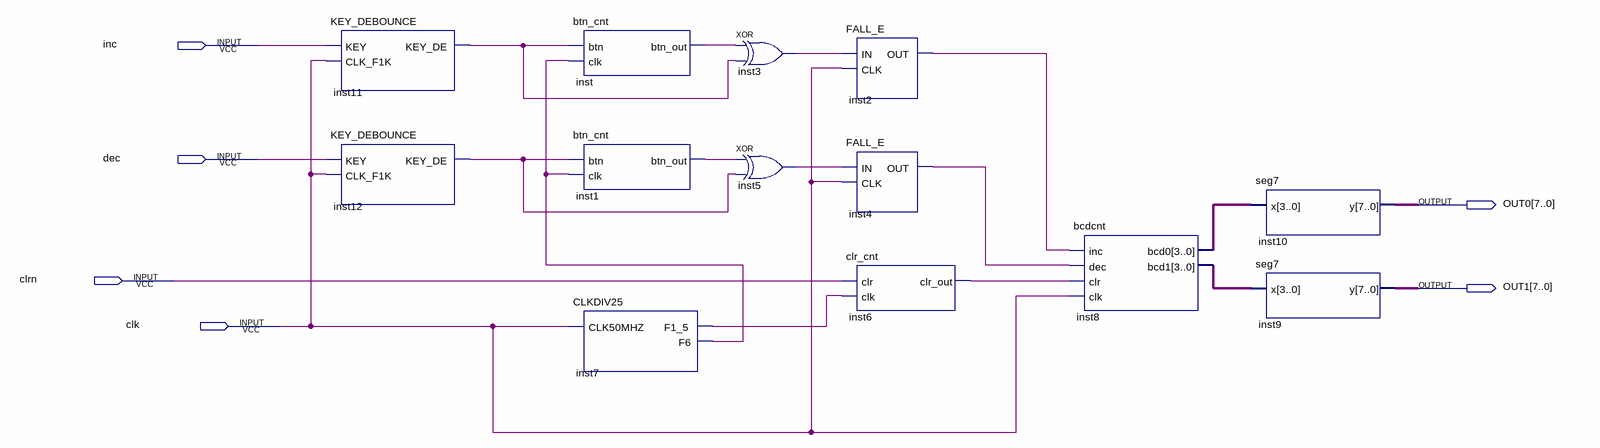
[diagram p0: schematic sheet]
// Quartus schematic TOP.bdf as structural Verilog: 13 symbols, 6 pins
module TOP (
  input  inc,
  input  dec,
  input  clrn,
  input  clk,
  output [7:0] OUT0,
  output [7:0] OUT1
);

  wire inst1_btn_out, inst2_out, inst3_out, inst4_out, inst5_out, inst6_clr_out, inst7_f1_5, inst7_f6,
       inst11_key_de, inst12_key_de, inst_btn_out;
  wire [3:0] inst8_bcd0, inst8_bcd1;

  KEY_DEBOUNCE inst11 (.KEY(inc), .CLK_F1K(clk), .KEY_DE(inst11_key_de));
  KEY_DEBOUNCE inst12 (.KEY(dec), .CLK_F1K(clk), .KEY_DE(inst12_key_de));
  btn_cnt inst (.btn(inst11_key_de), .clk(inst7_f6), .btn_out(inst_btn_out));
  btn_cnt inst1 (.btn(inst12_key_de), .clk(inst7_f6), .btn_out(inst1_btn_out));
  CLKDIV25 inst7 (.CLK50MHZ(clk), .F1_5(inst7_f1_5), .F6(inst7_f6));
  xor inst3 (inst3_out, inst_btn_out, inst11_key_de);
  xor inst5 (inst5_out, inst1_btn_out, inst12_key_de);
  FALL_E inst2 (.IN(inst3_out), .CLK(clk), .OUT(inst2_out));
  FALL_E inst4 (.IN(inst5_out), .CLK(clk), .OUT(inst4_out));
  clr_cnt inst6 (.clr(clrn), .clk(inst7_f1_5), .clr_out(inst6_clr_out));
  bcdcnt inst8 (.inc(inst2_out), .dec(inst4_out), .clr(inst6_clr_out), .clk(clk), .bcd0(inst8_bcd0), .bcd1(inst8_bcd1));
  seg7 inst10 (.x(inst8_bcd0), .y(OUT0));
  seg7 inst9 (.x(inst8_bcd1), .y(OUT1));
endmodule
